# EAGLE design Laser Trip Detector (EAGLE 6.5.0)
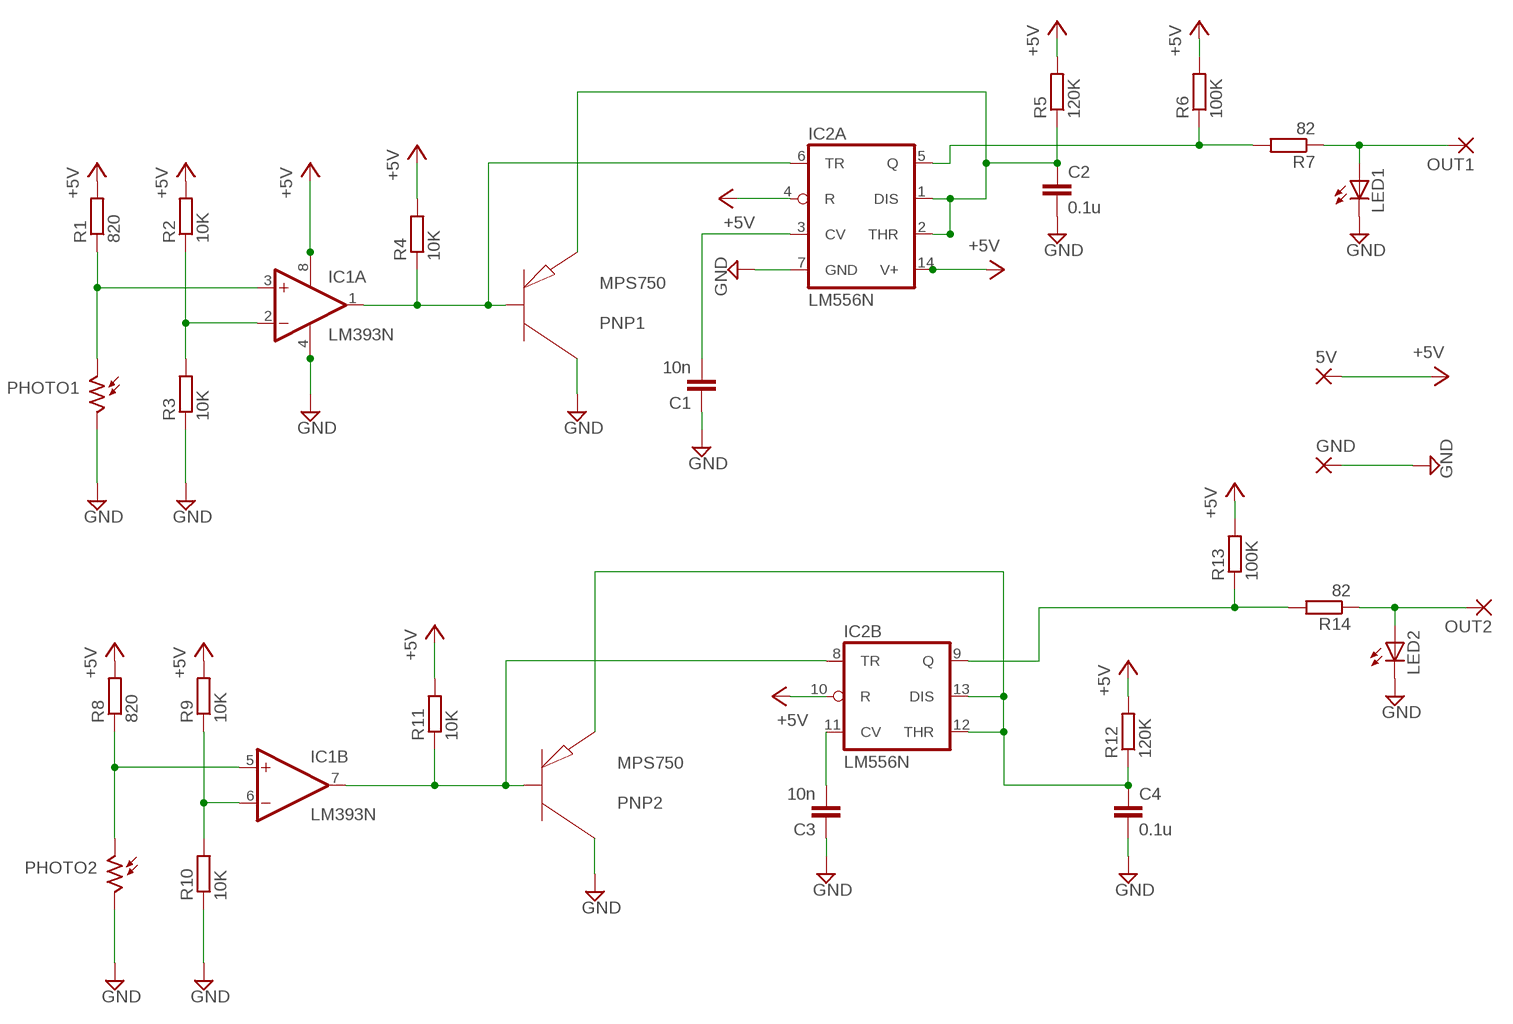
[diagram p0: schematic, sheet 1]

## Parts
5V  3,17/1,3  [3,17/1,3]
C1  10n  C5/3  [C5B3]
C2  0.1u  C5/3  [C5B3]
C3  10n  C5/3  [C5B3]
C4  0.1u  C5/3  [C5B3]
GND  3,17/1,3  [3,17/1,3]
IC1  LM393N  [DIL08]
IC2  LM556N  [DIL14]
LED1  LED5MM  [LED5MM]
LED2  LED5MM  [LED5MM]
OUT1  3,17/1,3  [3,17/1,3]
OUT2  3,17/1,3  [3,17/1,3]
PHOTO1  M9960_11A  [M9960]
PHOTO2  M9960_11A  [M9960]
PNP1  MPS750  2N3906  [TO92]
PNP2  MPS750  2N3906  [TO92]
R1  820  R0207/10  [0207/10]
R2  10K  R0207/10  [0207/10]
R3  10K  R0207/10  [0207/10]
R4  10K  R0207/10  [0207/10]
R5  120K  R0207/10  [0207/10]
R6  100K  R0207/10  [0207/10]
R7  82  R0207/10  [0207/10]
R8  820  R0207/10  [0207/10]
R9  10K  R0207/10  [0207/10]
R10  10K  R0207/10  [0207/10]
R11  10K  R0207/10  [0207/10]
R12  120K  R0207/10  [0207/10]
R13  100K  R0207/10  [0207/10]
R14  82  R0207/10  [0207/10]

## Nets
+5V: 5V.1(P) IC1.8(P:V+) IC2.4(A:R) IC2.10(B:R) IC2.14(A:V+) R1.2 R2.2 R4.2 R5.2 R6.2 R8.2 R9.2 R11.2 R12.2 R13.2
GND: C1.1 C2.2 C3.1 C4.2 GND.1(P) IC1.4(P:V-) IC2.7(A:GND) LED1.K(C) LED2.K(C) PHOTO1.2 PHOTO2.2 PNP1.1(C) PNP2.1(C) R3.1 R10.1
N$1: IC1.2(A:-IN) R2.1 R3.2
N$2: IC1.3(A:+IN) PHOTO1.1 R1.1
N$3: IC1.1(A:OUT) IC2.6(A:TR) PNP1.2(B) R4.1
N$4: C1.2 IC2.3(A:CV)
N$5: C2.1 IC2.1(A:DIS) IC2.2(A:THR) PNP1.3(E) R5.1
N$6: IC2.5(A:Q) R6.1 R7.2
N$7: LED1.A OUT1.1(P) R7.1
N$8: IC1.6(B:-IN) R9.1 R10.2
N$9: IC1.5(B:+IN) PHOTO2.1 R8.1
N$10: IC1.7(B:OUT) IC2.8(B:TR) PNP2.2(B) R11.1
N$11: C3.2 IC2.11(B:CV)
N$14: C4.1 IC2.12(B:THR) IC2.13(B:DIS) PNP2.3(E) R12.1
N$15: IC2.9(B:Q) R13.1 R14.2
N$16: LED2.A OUT2.1(P) R14.1

## Library data of the parts
5V GND OUT1 OUT2 = wirepad:3,17/1,3: THROUGH-HOLE PAD
C1-C4 = capacitor-wima:C: CAPACITOR naming: grid - package width
IC1 = linear:LM393: COMPARATOR
IC2 = linear:*556: Dual TIMER
LED1 LED2 = led:LED: LED OSRAM: - CHIPLED LG R971, LG N971, LY N971, LG Q971, LY Q971, LO R971, LY R971 LH N974, LH R974 LS Q976, LO Q976, LY Q976 LO Q996 - Hyper CHIPLED LW Q18S LB Q993, LB Q99A, LB R99A - SideLED LS A670, LO A670, LY A670, LG A670, LP A670 LB A673, LV A673, LT A673, LW A673 LH A674 LY A675 LS A676, LA A676, LO A676, LY A676, LW A676 LS A679, LY A679, LG A679 - Hyper Micro SIDELED® LS Y876, LA Y876, LO Y876, LY Y876 LT Y87S - SmartLED LW L88C, LW L88S LB L89C, LB L89S, LG L890 LS L89K, LO L89K, LY L89K LS L896, LA L896, LO L896, LY L896 - TOPLED LS T670, LO T670, LY T670, LG T670, LP T670 LSG T670, LSP T670, LSY T670, LOP T670, LYG T670 LG T671, LOG T671, LSG T671 LB T673, LV T673, LT T673, LW T673 LH T674 LS T676, LA T676, LO T676, LY T676, LB T676, LH T676, LSB T676, LW T676 LB T67C, LV T67C, LT T67C, LS T67K, LO T67K, LY T67K, LW E67C LS E67B, LA E67B, LO E67B, LY E67B, LB E67C, LV E67C, LT E67C LW T67C LS T679, LY T679, LG T679 LS T770, LO T770, LY T770, LG T770, LP T770 LB T773, LV T773, LT T773, LW T773 LH T774 LS E675, LA E675, LY E675, LS T675 LS T776, LA T776, LO T776, LY T776, LB T776 LHGB T686 LT T68C, LB T68C - Hyper Mini TOPLED® LB M676 - Mini TOPLED Santana® LG M470 LS M47K, LO M47K, LY M47K Source: http://www.osram.convergy.de LUXEON: - LUMILED® LXK2-PW12-R00, LXK2-PW12-S00, LXK2-PW14-U00, LXK2-PW14-V00 LXK2-PM12-R00, LXK2-PM12-S00, LXK2-PM14-U00 LXK2-PE12-Q00, LXK2-PE12-R00, LXK2-PE12-S00, LXK2-PE14-T00, LXK2-PE14-U00 LXK2-PB12-K00, LXK2-PB12-L00, LXK2-PB12-M00, LXK2-PB14-N00, LXK2-PB14-P00, LXK2-PB14-Q00 LXK2-PR12-L00, LXK2-PR12-M00, LXK2-PR14-Q00, LXK2-PR14-R00 LXK2-PD12-Q00, LXK2-PD12-R00, LXK2-PD12-S00 LXK2-PH12-R00, LXK2-PH12-S00 LXK2-PL12-P00, LXK2-PL12-Q00, LXK2-PL12-R00 Source: www.luxeon.com KINGBRIGHT: KA-3528ASYC Source: www.kingbright.com
PHOTO1 PHOTO2 = photo-elements:M9960_11: Photo Sensor Beacon Light, Photometer Applications Source: http://optoelectronics.perkinelmer.com/content/Datasheets/DTS_M9960.pdf
PNP1 PNP2 = sym:2N3906: General Purpose Transistors PNP Silicon Source: Dat aSheet <http://www.onsemi.com/pub_link/Collateral/2N3906-D.PDF>
R1-R14 = eagle-ltspice:R: RESISTOR, European symbol; SPICEMODEL: NONE; SPICEPREFIX: R

## Board
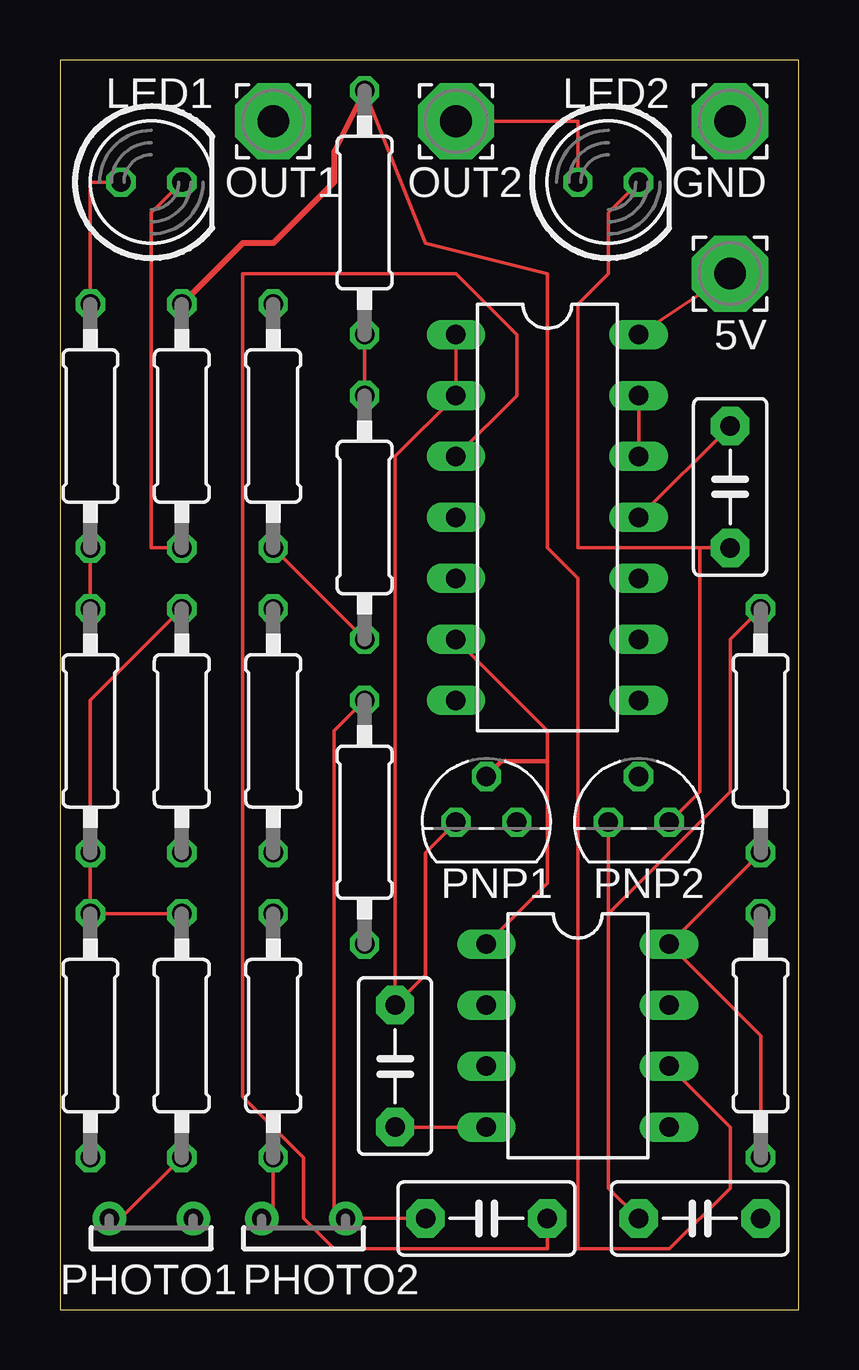
[diagram p1: board, top side]
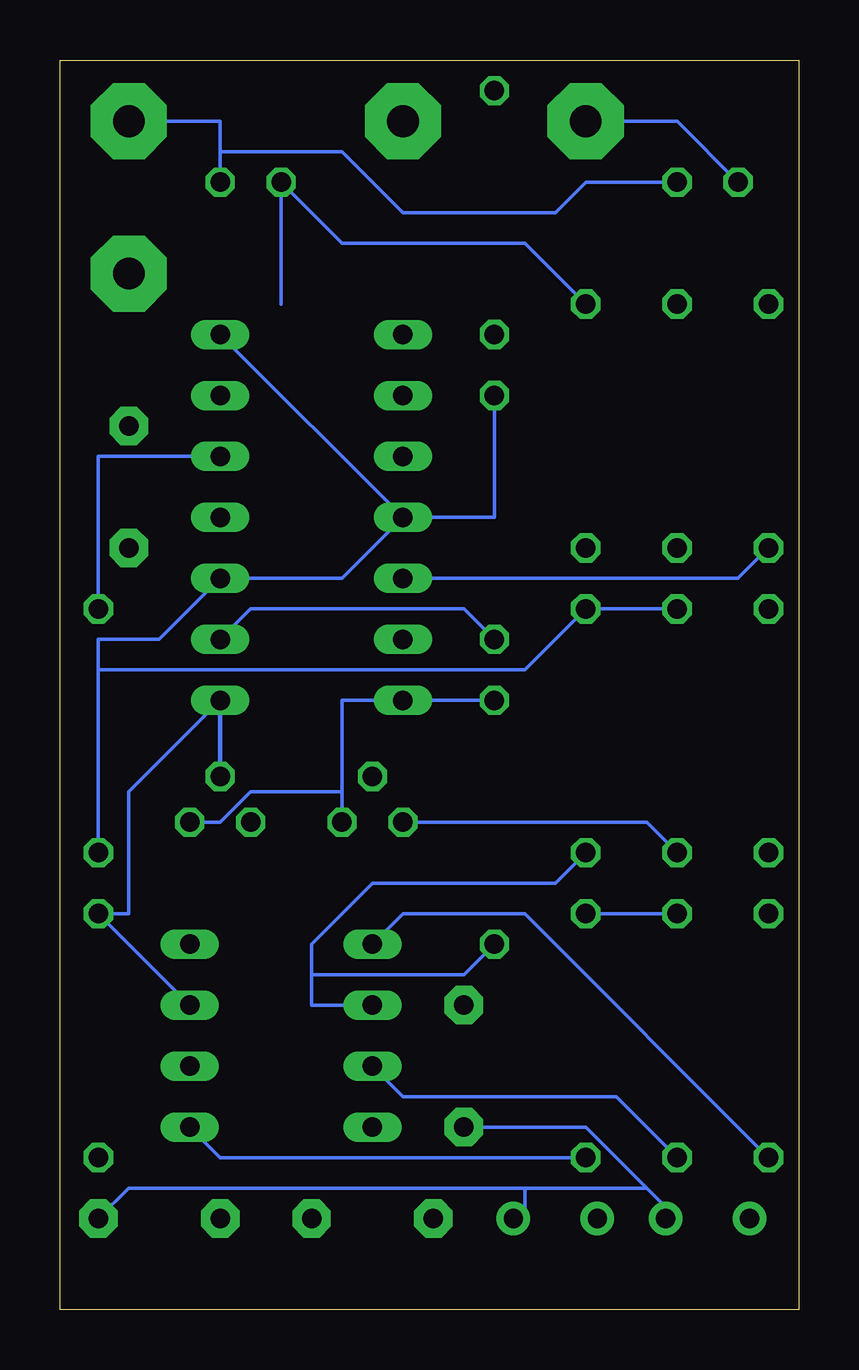
[diagram p2: board, bottom side, seen from below]

Size 30.81 x 52.08 mm. Coordinates in mm from the lower left corner, seen from the top.
Outline: 0,0 30.81,0 30.81,52.08 0.01,52.07 0,0
Copper layers (1*16): Top 0.0356mm / dielectric 1.5011mm / Bottom 0.0356mm
Design rules "LaenPCBOrder": minimum track width 6mil, minimum drill 13mil, track to track 6mil, track to pad 6mil, pad to pad 6mil, via to via 6mil, smd to smd 6mil, copper to edge 15mil, drill to drill 6mil, minimum pad ring 7mil, minimum via ring 7mil, stop-mask expansion 3mil, vias tented up to drill 0mil, thermal gap 10mil

### Footprints (pad centres in the part's own frame; a part is rotated, then mirrored left to right if it is on the bottom)
3,17/1,3 = drill 1.321 pad 3.175 octagon: 1 0,0
C5B3 = drill 0.813 pad 1.6 octagon: 1 -2.54,0; 2 2.54,0
DIL08 = drill 0.813 long: 1 -3.81,-3.81; 2 -1.27,-3.81; 3 1.27,-3.81; 4 3.81,-3.81; 5 3.81,3.81; 6 1.27,3.81; 7 -1.27,3.81; 8 -3.81,3.81
DIL14 = drill 0.813 long: 1 -7.62,-3.81; 2 -5.08,-3.81; 3 -2.54,-3.81; 4 0,-3.81; 5 2.54,-3.81; 6 5.08,-3.81; 7 7.62,-3.81; 8 7.62,3.81; 9 5.08,3.81; 10 2.54,3.81; 11 0,3.81; 12 -2.54,3.81; 13 -5.08,3.81; 14 -7.62,3.81
LED5MM = drill 0.813 octagon: A -1.27,0; K 1.27,0
M9960 = drill 0.8 pad 1.4: 1 -1.75,0; 2 1.75,0
TO92 = drill 0.813 octagon: 1 1.27,0; 2 0,1.905; 3 -1.27,0
0207/10 = drill 0.813 octagon: 1 -5.08,0; 2 5.08,0

### Placement (x,y rotation side)
5V  27.94,43.18 180 top
C1  17.78,3.81 0 top
C2  13.97,10.16 270 top
C3  27.94,34.29 90 top
C4  26.67,3.81 0 top
GND  27.94,49.53 180 top
IC1  21.59,11.43 270 top
IC2  20.32,33.02 270 top
LED1  3.81,46.99 0 top
LED2  22.86,46.99 0 top
OUT1  8.89,49.53 180 top
OUT2  16.51,49.53 180 top
PHOTO1  3.81,3.81 0 top
PHOTO2  10.16,3.81 0 top
PNP1  17.78,20.32 0 top
PNP2  24.13,20.32 0 top
R1  5.08,11.43 90 top
R2  8.89,24.13 90 top
R3  12.7,20.32 270 top
R4  1.27,11.43 90 top
R5  5.08,24.13 90 top
R6  1.27,24.13 270 top
R7  1.27,36.83 270 top
R8  8.89,11.43 90 top
R9  12.7,45.72 270 top
R10  5.08,36.83 90 top
R11  29.21,11.43 270 top
R12  29.21,24.13 270 top
R13  12.7,33.02 90 top
R14  8.89,36.83 270 top

### Tracks (layer width: path | path; a pad name or v marks a point on that pad's centre or on a via)
+5V
  Top 0.152: R1.2 R4.2 R6.2 1.27,25.4 R5.2 | R12.2 IC1.8 29.21,11.43 R11.2 | 5V.1 IC2.14 | R9.2 R13.2
  Bottom 0.152: R5.2 R2.2 11.43,26.67 29.21,26.67 | R1.2 R8.2 | IC2.4 19.05,30.48 IC2.10 26.67,27.94 29.21,27.94 29.21,26.67 | R13.2 12.7,33.02 IC2.4 | IC2.4 IC2.14 | 29.21,26.67 R12.2
GND
  Top 0.152: C1.1 PHOTO2.2 11.43,3.81 11.43,24.13 R3.1 | C2.2 IC1.4 | R10.1 3.81,31.75 3.81,45.72 LED1.K | 26.67,31.75 21.59,31.75 21.59,41.91 22.86,43.18 22.86,45.72 LED2.K | 26.67,31.75 C3.1 | PNP2.1 26.67,21.59 26.67,31.75
  Bottom 0.152: 6.35,5.08 8.89,7.62 C2.2 | 6.35,5.08 5.08,3.81 PHOTO1.2 | C4.2 27.94,5.08 11.43,5.08 | 6.35,5.08 11.43,5.08 | 11.43,5.08 11.43,3.81 PHOTO2.2 | R3.1 IC2.7 19.05,25.4 19.05,21.59 | 19.05,21.59 PNP1.1 | PNP2.1 24.13,20.32 22.86,21.59 19.05,21.59 | 24.13,48.26 24.13,49.53 GND.1 | 24.13,48.26 LED2.K | LED1.K 8.89,46.99 10.16,45.72 16.51,45.72 19.05,48.26 24.13,48.26
N$1
  Bottom 0.152: R2.1 10.16,17.78 17.78,17.78 20.32,15.24 20.32,13.97 | 20.32,13.97 20.32,12.7 IC1.2 | R3.2 13.97,13.97 20.32,13.97
N$2
  Top 0.152: R1.1 2.54,3.81 PHOTO1.1
  Bottom 0.152: IC1.3 16.51,8.89 7.62,8.89 R1.1
N$3
  Top 0.152: IC2.6 20.32,24.13 20.32,22.86 20.32,17.78 IC1.1
  Top 0.191: PNP1.2 18.41,22.86 20.32,22.86
  Bottom 0.152: R4.1 11.43,16.51 16.51,16.51 IC1.1
N$4
  Top 0.152: IC2.3 19.05,38.1 19.05,40.64 16.51,43.18 7.62,43.18 7.62,8.89 10.16,6.35 10.16,3.81 11.43,2.54 20.32,2.54 C1.2
N$5
  Top 0.152: IC2.1 IC2.2 13.97,35.56 C2.1 15.24,13.97 15.24,19.05 PNP1.3
  Bottom 0.152: R5.1 6.35,20.32 PNP1.3
N$6
  Top 0.152: R7.2 R6.1
  Bottom 0.152: IC2.5 2.54,30.48 R7.2
N$7
  Top 0.152: R7.1 1.27,46.99 LED1.A
  Bottom 0.152: LED1.A 5.08,49.53 OUT1.1
N$8
  Top 0.152: IC1.6 27.94,7.62 27.94,5.08 25.4,2.54 21.59,2.54 21.59,30.48 20.32,31.75 20.32,43.18 15.24,44.45 R9.1
  Top 0.254: R9.1 11.43,48.26 11.43,46.99 8.89,44.45 7.62,44.45 R10.2
N$9
  Top 0.152: R8.1 8.89,3.81 PHOTO2.1
  Bottom 0.152: IC1.5 24.13,6.35 R8.1
N$10
  Bottom 0.152: IC1.7 R11.1 27.94,16.51 27.94,21.59 IC2.8
  Bottom 0.191: PNP2.2 IC2.8
N$11
  Top 0.152: C3.2 IC2.11
N$14
  Top 0.152: IC2.12 IC2.13 | 22.86,16.51 22.86,5.08 C4.1 | 22.86,16.51 PNP2.3 | R12.1 27.94,27.94 27.94,21.59 22.86,16.51
  Bottom 0.152: R12.1 29.21,35.56 IC2.12
N$15
  Top 0.152: R14.2 R13.1
  Bottom 0.152: IC2.9 22.86,29.21 13.97,29.21 R13.1
N$16
  Top 0.152: OUT2.1 21.59,49.53 LED2.A
  Bottom 0.152: R14.1 11.43,44.45 19.05,44.45 LED2.A 21.59,41.91